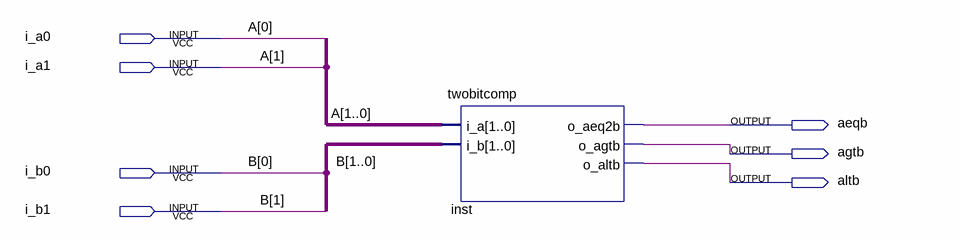
[diagram p0: schematic sheet]
// Quartus schematic twobitcomp_vhdl.bdf as structural Verilog: 1 symbols, 7 pins
module twobitcomp_vhdl (
  input  i_a0,
  input  i_a1,
  input  i_b0,
  input  i_b1,
  output aeqb,
  output agtb,
  output altb
);

  twobitcomp inst (.i_a({i_a1, i_a0}), .i_b({i_b1, i_b0}), .o_aeq2b(aeqb), .o_agtb(agtb), .o_altb(altb));

  // Other names for the same wires on the sheet: A[1:0] = {i_a1, i_a0}; B[1:0] = {i_b1, i_b0}
endmodule
